# Altium project isa_fdc.PrjPcb
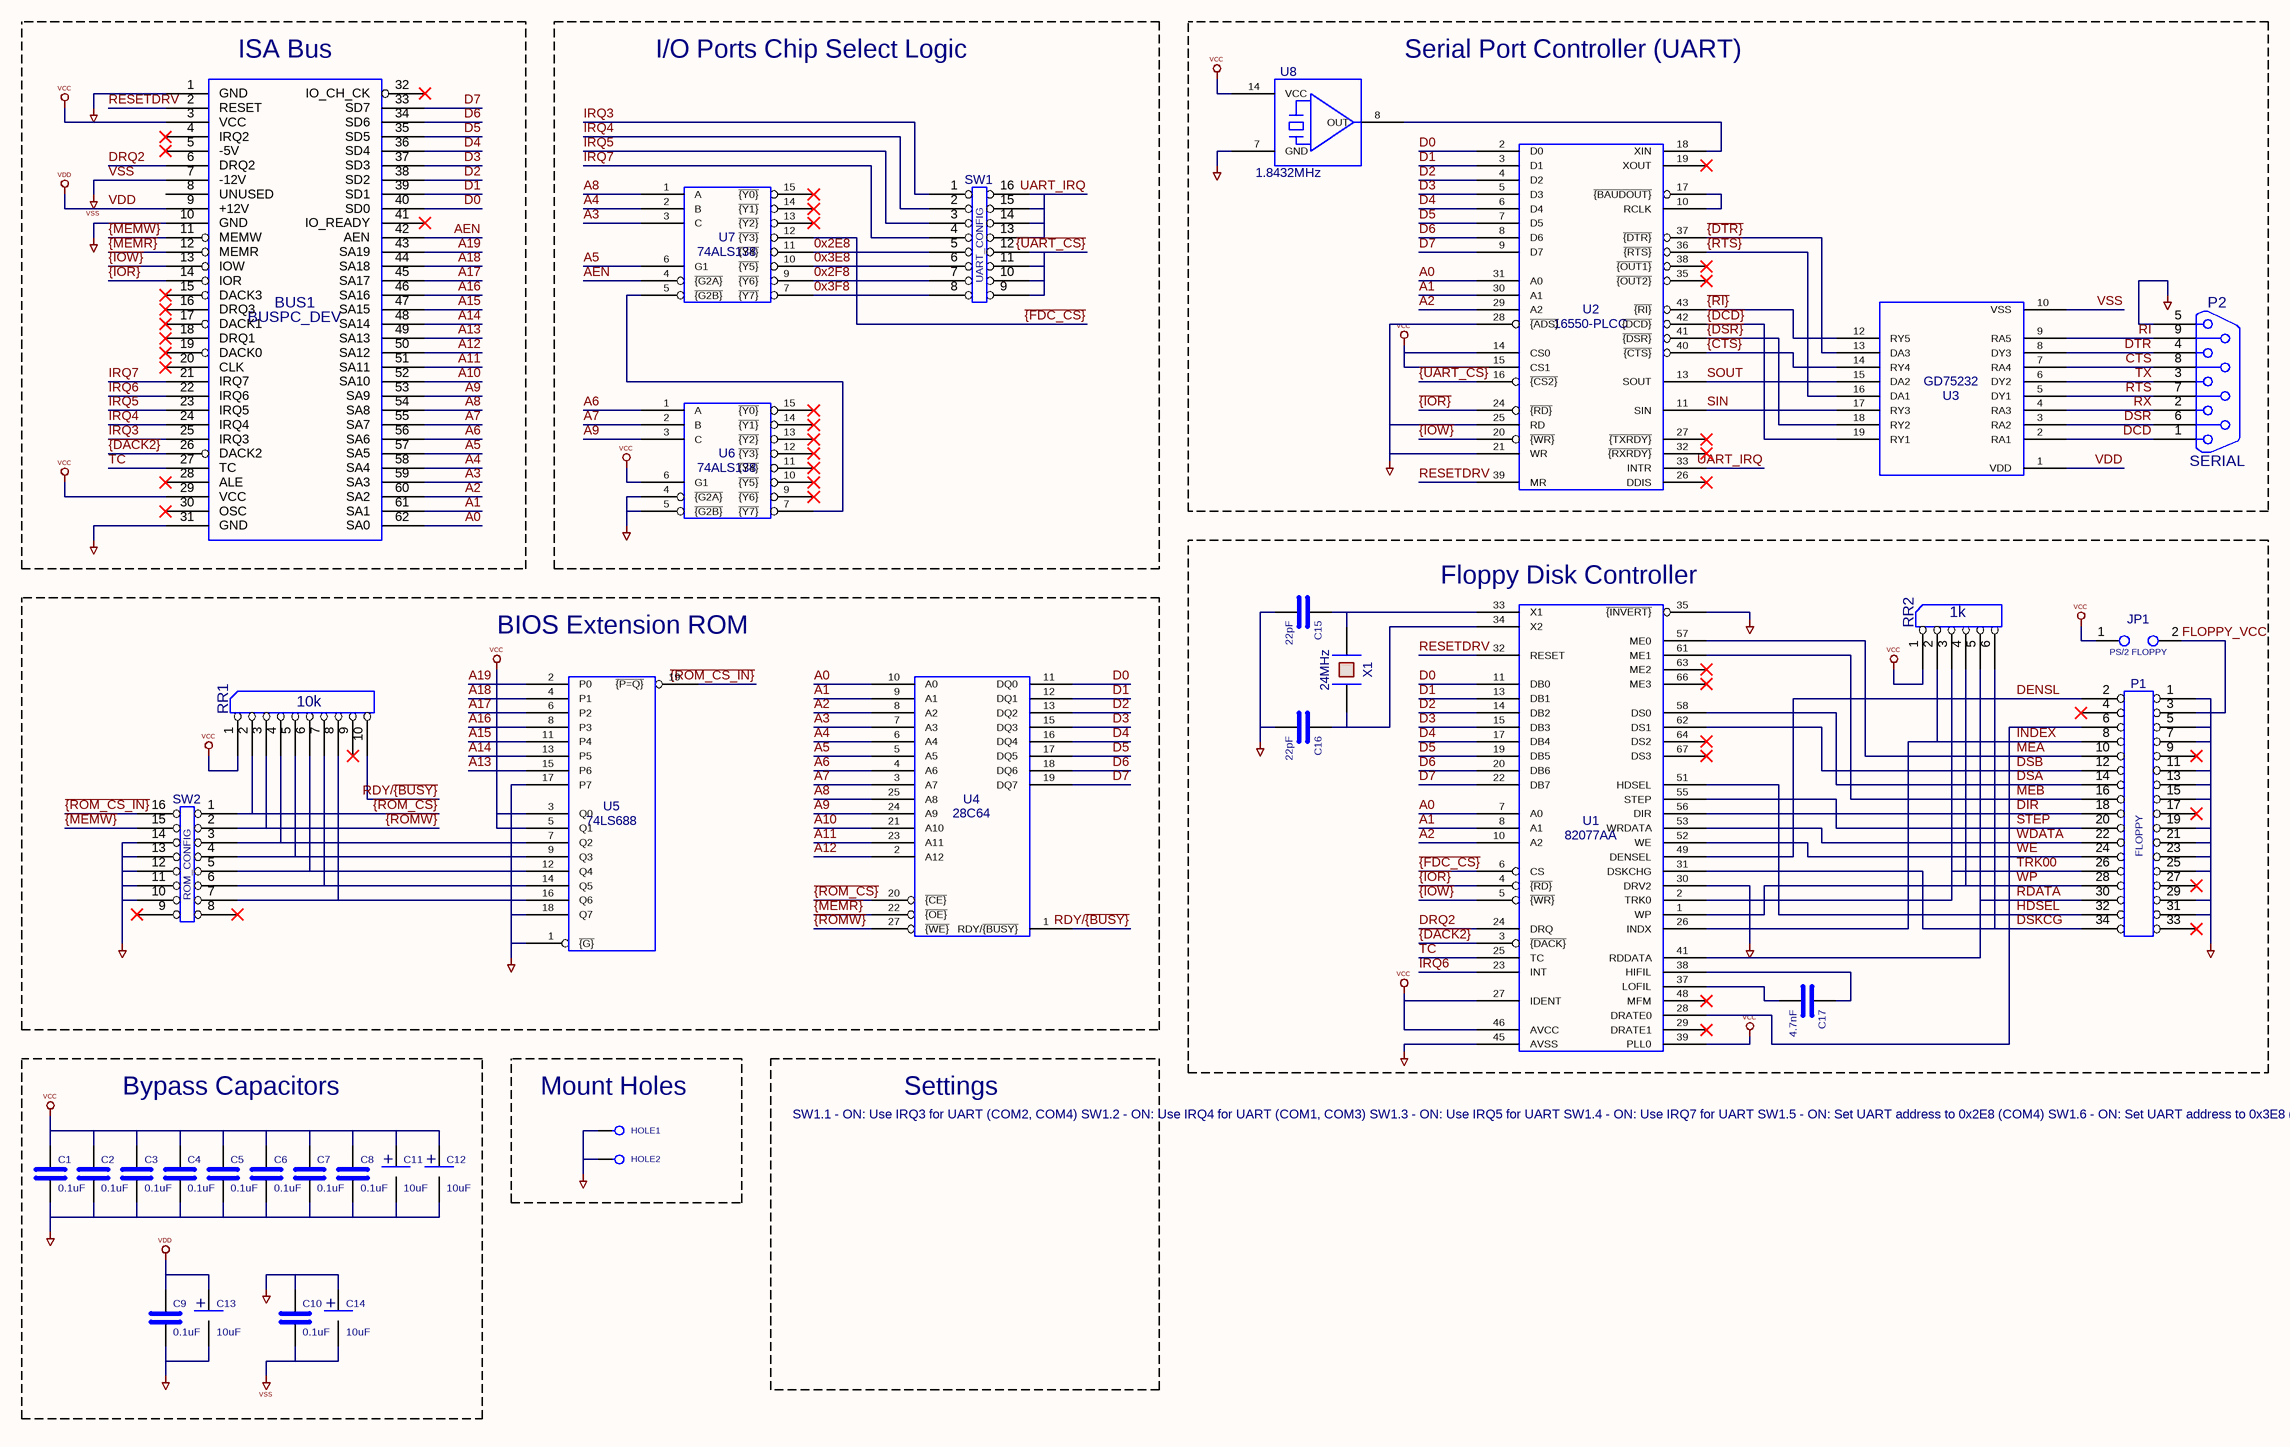
[diagram p0: isa_fdc.SchDoc]
1 sheet, 36 parts. Net scope: global (net labels, ports and power ports of the same name join across sheets).
Board file: isa_fdc.PcbDoc

## Sheet isa_fdc.SchDoc
size 431 x 279 mm

### Parts
BUS1  BUSPC_DEV
C1  0.1uF
C2  0.1uF
C3  0.1uF
C4  0.1uF
C5  0.1uF
C6  0.1uF
C7  0.1uF
C8  0.1uF
C9  0.1uF
C10  0.1uF
C11  10uF
C12  10uF
C13  10uF
C14  10uF
C15  22pF
C16  22pF
C17  4.7nF
HOLE1  CONN_1  (value not drawn)
HOLE2  CONN_1  (value not drawn)
JP1  PS/2 FLOPPY
P1  FLOPPY
P2  SERIAL
RR1  10k
RR2  1k
SW1  UART_CONFIG
SW2  ROM_CONFIG
U1  82077AA
U2  16550-PLCC
U3  GD75232
U4  28C64
U5  74LS688
U6  74ALS138
U7  74ALS138
U8  1.8432MHz
X1  24MHz

### Blocks framed on the sheet
ISA Bus: BUS1
I/O Ports Chip Select Logic: SW1 U6 U7
Serial Port Controller (UART): P2 U2 U3 U8
Floppy Disk Controller: C15-C17 JP1 P1 RR2 U1 X1
BIOS Extension ROM: RR1 SW2 U4 U5
Bypass Capacitors: C1-C14
Mount Holes: HOLE1 HOLE2

### Nets
GND: BUS1.1(GND) BUS1.10(GND) BUS1.31(GND) C1.2 C2.2 C3.2 C4.2 C5.2 C6.2 C7.2 C8.2 C9.2 C10.1 C11.2 C12.2 C13.2 C14.1 C15.2 C16.2 HOLE1.1 HOLE2.1 P1.1(P1) P1.5(P5) P1.7(P7) P1.11(P11) P1.13(P13) P1.15(P15) P1.19(P19) P1.21(P21) P1.23(P23) P1.25 P1.29(P29) P1.31(P31) P2.5 SW2.10 SW2.11 SW2.12 SW2.13 SW2.14 U1.30(DRV2) U1.35(~{{INVERT}}) U1.45(AVSS) U2.21(WR) U2.25(RD) U2.28(~{{ADS}}) U5.1(~{{G}}) U5.17(P7) U5.18(Q7) U6.4(~{{G2A}}) U6.5(~{{G2B}}) U8.7(GND)
VCC: BUS1.3(VCC) BUS1.29(VCC) C1.1 C2.1 C3.1 C4.1 C5.1 C6.1 C7.1 C8.1 C11.1 C12.1 JP1.1 RR1.1(COM) RR2.1(COM) U1.27(IDENT) U1.39(PLL0) U1.46(AVCC) U2.14(CS0) U2.15(CS1) U5.3(Q0) U5.5(Q1) U6.6(G1) U8.14(VCC)
VDD: BUS1.9(+12V) C9.1 C13.1 U3.1(VDD)
VSS: BUS1.7(-12V) C10.2 C14.2 U3.10(VSS)
0x2E8: SW1.5 U7.11(~{{Y4}})
0x2F8: SW1.7 U7.9(~{{Y6}})
0x3E8: SW1.6 U7.10(~{{Y5}})
0x3F8: SW1.8 U7.7(~{{Y7}})
A0: BUS1.62(SA0) U1.7(A0) U2.31(A0) U4.10(A0)
A1: BUS1.61(SA1) U1.8(A1) U2.30(A1) U4.9(A1)
A2: BUS1.60(SA2) U1.10(A2) U2.29(A2) U4.8(A2)
A3: BUS1.59(SA3) U4.7(A3) U7.3(C)
A4: BUS1.58(SA4) U4.6(A4) U7.2(B)
A5: BUS1.57(SA5) U4.5(A5) U7.6(G1)
A6: BUS1.56(SA6) U4.4(A6) U6.1(A)
A7: BUS1.55(SA7) U4.3(A7) U6.2(B)
A8: BUS1.54(SA8) U4.25(A8) U7.1(A)
A9: BUS1.53(SA9) U4.24(A9) U6.3(C)
A10: BUS1.52(SA10) U4.21(A10)
A11: BUS1.51(SA11) U4.23(A11)
A12: BUS1.50(SA12) U4.2(A12)
A13: BUS1.49(SA13) U5.15(P6)
A14: BUS1.48(SA14) U5.13(P5)
A15: BUS1.47(SA15) U5.11(P4)
A16: BUS1.46(SA16) U5.8(P3)
A17: BUS1.45(SA17) U5.6(P2)
A18: BUS1.44(SA18) U5.4(P1)
A19: BUS1.43(SA19) U5.2(P0)
AEN: BUS1.42(AEN) U7.4(~{{G2A}})
CTS: P2.8(P8) U3.7(RA4)
D0: BUS1.40(SD0) U1.11(DB0) U2.2(D0) U4.11(DQ0)
D1: BUS1.39(SD1) U1.13(DB1) U2.3(D1) U4.12(DQ1)
D2: BUS1.38(SD2) U1.14(DB2) U2.4(D2) U4.13(DQ2)
D3: BUS1.37(SD3) U1.15(DB3) U2.5(D3) U4.15(DQ3)
D4: BUS1.36(SD4) U1.17(DB4) U2.6(D4) U4.16(DQ4)
D5: BUS1.35(SD5) U1.19(DB5) U2.7(D5) U4.17(DQ5)
D6: BUS1.34(SD6) U1.20(DB6) U2.8(D6) U4.18(DQ6)
D7: BUS1.33(SD7) U1.22(DB7) U2.9(D7) U4.19(DQ7)
DCD: P2.1 U3.2(RA1)
DENSL: P1.2(P2) U1.49(DENSEL)
DIR: P1.18(P18) U1.56(DIR)
DRQ2: BUS1.6(DRQ2) U1.24(DRQ)
DSA: P1.14(P14) U1.58(DS0)
DSB: P1.12(P12) U1.62(DS1)
DSKCG: P1.34(P34) RR2.6 U1.31(DSKCHG)
DSR: P2.6(P6) U3.3(RA2)
DTR: P2.4 U3.8(DY3)
FLOPPY_VCC: JP1.2 P1.3(P3)
HDSEL: P1.32(P32) U1.51(HDSEL)
INDEX: P1.8(P8) RR2.2 U1.26(INDX)
IRQ3: BUS1.25(IRQ3) SW1.1
IRQ4: BUS1.24(IRQ4) SW1.2
IRQ5: BUS1.23(IRQ5) SW1.3
IRQ6: BUS1.22(IRQ6) U1.23(INT)
IRQ7: BUS1.21(IRQ7) SW1.4
MEA: P1.10(P10) U1.57(ME0)
MEB: P1.16(P16) U1.61(ME1)
RDATA: P1.30(P30) RR2.5 U1.41(RDDATA)
RDY/~{{BUSY}}: RR1.10 U4.1(RDY/~{{BUSY}})
RESETDRV: BUS1.2(RESET) U1.32(RESET) U2.39(MR)
RI: P2.9(P9) U3.9(RA5)
RTS: P2.7(P7) U3.5(DY1)
RX: P2.2 U3.4(RA3)
SIN: U2.11(SIN) U3.17(RY3)
SOUT: U2.13(SOUT) U3.15(DA2)
STEP: P1.20(P20) U1.55(STEP)
TC: BUS1.27(TC) U1.25(TC)
TRK00: P1.26(P26) RR2.3 U1.2(TRK0)
TX: P2.3 U3.6(DY2)
UART_IRQ: SW1.13 SW1.14 SW1.15 SW1.16 U2.33(INTR)
WDATA: P1.22(P22) U1.53(WRDATA)
WE: P1.24(P24) U1.52(WE)
WP: P1.28(P28) RR2.4 U1.1(WP)
~{{CTS}}: U2.40(~{{CTS}}) U3.14(RY4)
~{{DACK2}}: BUS1.26(DACK2) U1.3(~{{DACK}})
~{{DCD}}: U2.42(~{{DCD}}) U3.19(RY1)
~{{DSR}}: U2.41(~{{DSR}}) U3.18(RY2)
~{{DTR}}: U2.37(~{{DTR}}) U3.13(DA3)
~{{FDC_CS}}: U1.6(CS) U7.12(~{{Y3}})
~{{IOR}}: BUS1.14(IOR) U1.4(~{{RD}}) U2.24(~{{RD}})
~{{IOW}}: BUS1.13(IOW) U1.5(~{{WR}}) U2.20(~{{WR}})
~{{MEMR}}: BUS1.12(MEMR) U4.22(~{{OE}})
~{{MEMW}}: BUS1.11(MEMW) SW2.15
~{{RI}}: U2.43(~{{RI}}) U3.12(RY5)
~{{ROM_CS_IN}}: SW2.16 U5.19(~{{P=Q}})
~{{ROM_CS}}: RR1.2 SW2.1 U4.20(~{{CE}})
~{{ROMW}}: RR1.3 SW2.2 U4.27(~{{WE}})
~{{RTS}}: U2.36(~{{RTS}}) U3.16(DA1)
~{{UART_CS}}: SW1.9 SW1.10 SW1.11 SW1.12 U2.16(~{{CS2}})
NetC15_1: C15.1 U1.33(X1) X1.1
NetC16_1: C16.1 U1.34(X2) X1.2
NetC17_1: C17.1 U1.38(HIFIL)
NetC17_2: C17.2 U1.37(LOFIL)
NetP1_6: P1.6(P6) U1.28(DRATE0)
NetRR1_4: RR1.4 SW2.3 U5.7(Q2)
NetRR1_5: RR1.5 SW2.4 U5.9(Q3)
NetRR1_6: RR1.6 SW2.5 U5.12(Q4)
NetRR1_7: RR1.7 SW2.6 U5.14(Q5)
NetRR1_8: RR1.8 SW2.7 U5.16(Q6)
NetU2_10: U2.10(RCLK) U2.17(~{{BAUDOUT}})
NetU2_18: U2.18(XIN) U8.8(OUT)
NetU6_7: U6.7(~{{Y7}}) U7.5(~{{G2B}})

Not connected (* = marked no-connect by the designer): BUS1 4(IRQ2)* 5(-5V)* 8(UNUSED) 15(DACK3)* 16(DRQ3)* 17(DACK1)* 18(DRQ1)* 19(DACK0)* 20(CLK)* 28(ALE)* 30(OSC)* 32(IO_CH_CK)* 41(IO_READY)*; P1 4(P4)* 9(P9)* 17(P17)* 27(P27)* 33(P33)*; RR1 9*; SW2 8* 9*; U1 9(GND) 12(GND) 16(GND) 18(VCC) 21(GND) 29(DRATE1)* 36(GND) 40(VCC) 42(NC) 43(NC) 44(NC) 47(NC) 48(MFM)* 50(GND) 54(GND) 59(GND) 60(VCC) 63(ME2)* 64(DS2)* 65(GND) 66(ME3)* 67(DS3)* 68(VCC); U2 1 12 19(XOUT)* 22(GND) 23 26(DDIS)* 27(~{{TXRDY}})* 32(~{{RXRDY}})* 34 35(~{{OUT2}})* 38(~{{OUT1}})* 44(VCC); U3 11(GND) 20(VCC); U4 14(GND) 26(NC) 28(VCC); U5 10(GND) 20(VCC); U6 8(GND) 9(~{{Y6}})* 10(~{{Y5}})* 11(~{{Y4}})* 12(~{{Y3}})* 13(~{{Y2}})* 14(~{{Y1}})* 15(~{{Y0}})* 16(VCC); U7 8(GND) 13(~{{Y2}})* 14(~{{Y1}})* 15(~{{Y0}})* 16(VCC)

### Notes on the sheet
- Settings
- SW1.1 - ON: Use IRQ3 for UART (COM2, COM4)
  SW1.2 - ON: Use IRQ4 for UART (COM1, COM3)
  SW1.3 - ON: Use IRQ5 for UART
  SW1.4 - ON: Use IRQ7 for UART
  SW1.5 - ON: Set UART address to 0x2E8 (COM4)
  SW1.6 - ON: Set UART address to 0x3E8 (COM3)
  SW1.7 - ON: Set UART address to 0x2F8 (COM2)
  SW1.8 - ON: Set UART address to 0x3F8 (COM1)
  SW2.1 - ON: Enable ROM
  SW2.2 - ON: Enable EEPROM write
  SW2.3 - ON: ROM A17 = 0; OFF: ROM A17 = 1
  SW2.4 - ON: ROM A16 = 0; OFF: ROM A16 = 1
  SW2.5 - ON: ROM A15 = 0; OFF: ROM A15 = 1
  SW2.6 - ON: ROM A14 = 0; OFF: ROM A14 = 1
  SW2.7 - ON: ROM A13 = 0; OFF: ROM A13 = 1
  SW2.8 - NOT USED
- 1
- 2
- 3
- 4
- 5
- 6
- 7
- 8
- A
- B
- C
- D
- E
- Title: Sergey's XT (C) 2010 Sergey Kiselev, GNU Free Documentation License (GFDL)
- File: isa_fdc.kicad_sch
- Sheet: /
- KiCad E.D.A.  kicad (5.1.4)-1
- Size: User
- Date: 19 dec 2012
- Rev:
- Id: 1/1
- (in symbol CP1) +

### Library data of the parts
C1-C10 C15-C17 = C
  C1-C10: Value: 0.1uF
  C15 C16: Value: 22pF
  C17: Value: 4.7nF
C11-C14 = CP1: Value: 10uF
JP1 = JUMPER: Value: PS/2 FLOPPY
P1 = CONN_17X2: Value: FLOPPY
P2 = DB9: Value: SERIAL
RR1 = RR9: Value: 10k
RR2 = RR5: Value: 1k
SW1 SW2 = DIL16
  SW1: Value: UART_CONFIG
  SW2: Value: ROM_CONFIG
U6 U7 = 74LS138: Value: 74ALS138
U8 = OSC: Value: 1.8432MHz
X1 = CRYSTAL: Value: 24MHz
BUS1 = BUSPC_DEV: Value: BUSPC_DEV
HOLE1 HOLE2 = CONN_1: Value: CONN_1
U1 = 82077AA: Value: 82077AA
U2 = 16550-PLCC: Value: 16550-PLCC
U3 = GD75232: Value: GD75232
U4 = 28C64: Value: 28C64
U5 = 74LS688: Value: 74LS688